# EAGLE schematic power-bridge (EAGLE 9.5.1)
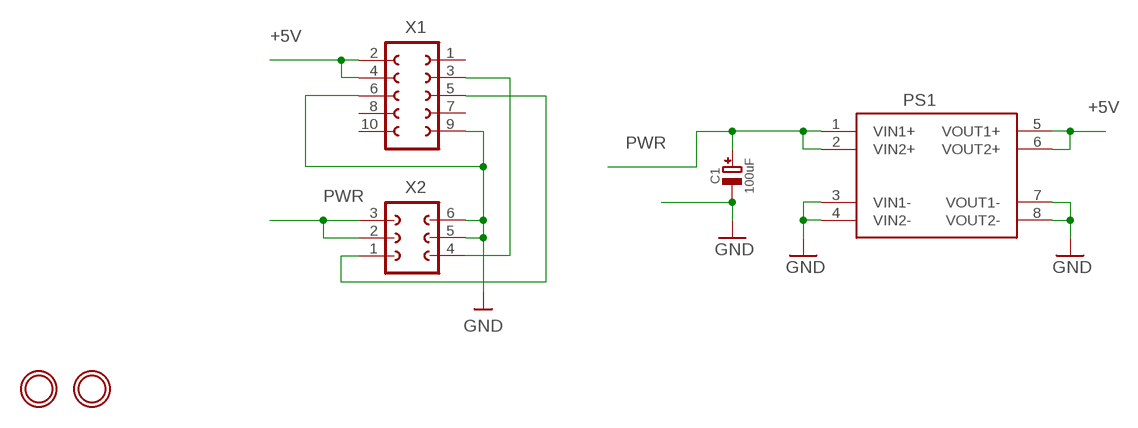
[diagram p0: schematic, sheet 1]

## Parts
C1  100uF  CAP_ELECTROLYTICPTH_3.5MMGRID_8MMDIA  [CELEC_3.5MM_8MM]
PS1  K8801MODULE  [K8801]
U$2  MOUNTINGHOLE2.7_THICK  [MOUNTINGHOLE_2.7_PLATED_THICK]
U$3  MOUNTINGHOLE2.7_THICK  [MOUNTINGHOLE_2.7_PLATED_THICK]
X1  CON-FE05-2  [FE05-2]
X2  CON-MA03-2PCB_EDGE  [PCB_EDGE_03-2]

## Nets
+5V: PS1.5(VOUT1+) PS1.6(VOUT2+) X1.2 X1.4
GND: C1.- PS1.3(VIN1-) PS1.4(VIN2-) PS1.7(VOUT1-) PS1.8(VOUT2-) X1.6 X1.9 X2.5 X2.6
N$1: X1.3 X2.4
N$2: X1.5 X2.1
PWR: C1.+ PS1.1(VIN1+) PS1.2(VIN2+) X2.2 X2.3
Unconnected: X1.1 X1.7 X1.8 X1.10

## Library data of the parts
C1 = sanisimov:CAP_ELECTROLYTIC: Electrolytic Capacitors SMT PANASONIC_C - Size C Panasonic Electrolytic Aluminum Capacitor 47µF 16V 20% Electrolytic Capacitor [Digikey: PCE3890TR-ND] PANASONIC_D - Size D Panasonic Electrolytic Aluminum Capacitor 100µF 25V 20% Electrolytic Capacitor [Digikey: PCE3898TR-ND] PTH 3.5 mm grid, 8 mm diameter ... 3.5 mm grid, 10 mm diameter ...
PS1 = sanisimov:K8801: 7V-28V to 5V DC-DC Step Down Power Supply Module Voltage Buck Converter 3A Power Supply Board Input voltage:DC 7V-28V Output valtage:DC 5V Output current:3A. max(2A for long time) Working frequency:570KHz Size:22*17.8*5mm
U$2 U$3 = sanisimov:MOUNTINGHOLE: Mounting Hole For #2 screws (0.086"/2.18mm width, 0.094"/2.4mm hole) use 2.5mm; BOM: EXCLUDE
X1 = sanisimov:CON-FE05-2: FEMALE HEADER
X2 = sanisimov:CON-MA03-2